# EasyEDA Pro project ProProject_Access Control EEPROM Programmer_2024-05-29.epro

# Schematic V2.0.1 Schematic
Create Date: 2024-05-29; Page Name: P1; Project Name: Access Control EEPROM Programmer; Schematic Name: V2.0.1 Schematic; Update Date: 2024-05-29; Company: EasyEDA.com; Drawn: Jim Heaney; Page Size: A4; Part Number: JLCPCB-002; Reviewed: Jim Heaney; Version: A
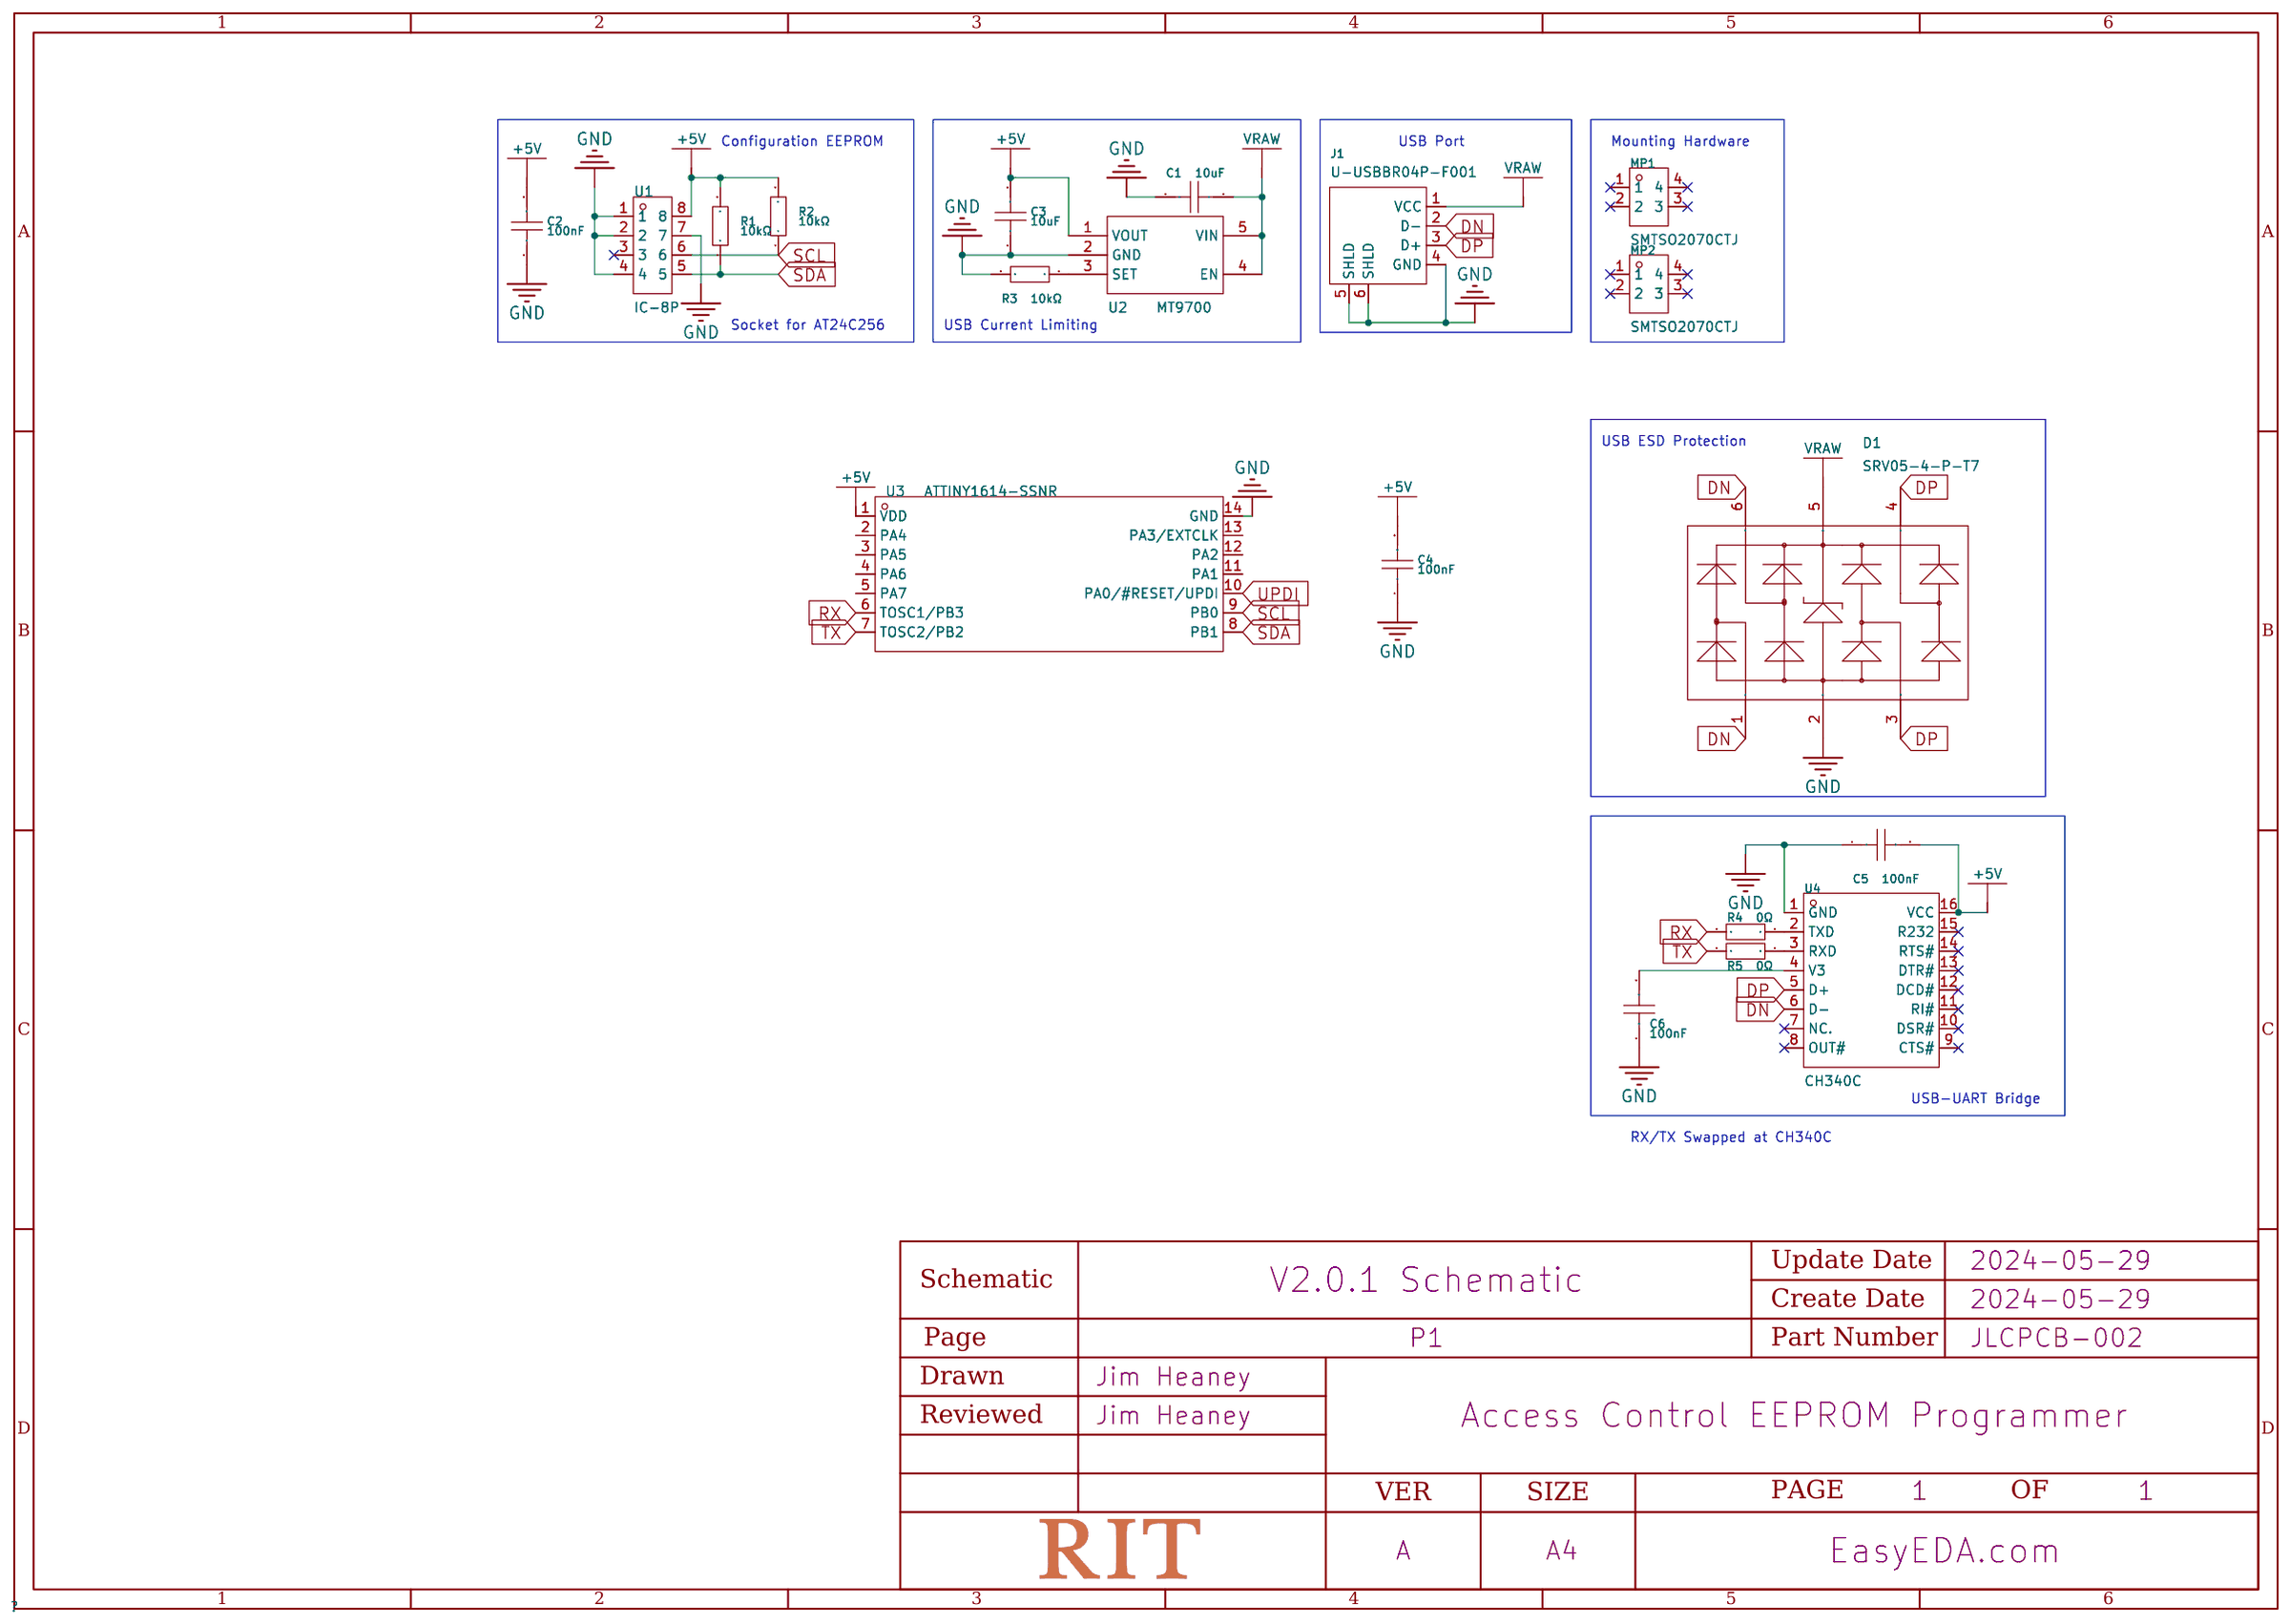
[diagram p0: schematic sheet]

## Parts
C1  10uF  [C0603]
C2  100nF  [C0603]
C3  10uF  [C0603]
C4  100nF  [C0603]
C5  100nF  [C0603]
C6  100nF  [C0603]
D1  SRV05-4-P-T7  [SOT-23-6_L2.9-W1.6-P0.95-LS2.8-BR]
J1  U-USBBR04P-F001  [USB-B-TH_U241-041N-1BR85-1]
MP1  SMTSO2070CTJ  [SMD_BD5.6-L5.6-W5.6-D3.6]
MP2  SMTSO2070CTJ  [SMD_BD5.6-L5.6-W5.6-D3.6]
R1  10kΩ  [R0603]
R2  10kΩ  [R0603]
R3  10kΩ  [R0603]
R4  0Ω  [R1206]
R5  0Ω  [R1206]
U1  IC-8P  [DIP-8_L10.2-W10.1-P2.54-LS7.6-BL]
U2  MT9700  [SOT-23-5_L3.0-W1.7-P0.95-LS2.8-BR]
U3  ATTINY1614-SSNR  [SOIC-14_L8.7-W3.9-P1.27-LS6.0-BL]
U4  CH340C  [SOP-16_L10.0-W3.9-P1.27-LS6.0-BL]

## Library data of the parts
C1 C3 = CL10A106MA8NRNC: Capacitance: Tolerance:±20% Tolerance:±20% Voltage Rated: Temperature Coefficient:; LCSC Part Name: 10uF ±20% 25V; Supplier Part: C96446; Manufacturer: SAMSUNG(三星); Supplier Footprint: 0603; JLCPCB Part Class: Basic Part; Datasheet: https://atta.szlcsc.com/upload/public/pdf/source/20160218/1457707763339.pdf; Supplier: LCSC; Tolerance: ±20%
C2 C4-C6 = CC0603KRX7R9BB104: Capacitance: Tolerance:±10% Tolerance:±10% Voltage Rated: Temperature Coefficient:; LCSC Part Name: 100nF ±10% 50V; Supplier Part: C14663; Manufacturer: YAGEO(国巨); Supplier Footprint: 0603; JLCPCB Part Class: Basic Part; Datasheet: https://atta.szlcsc.com/upload/public/pdf/source/20180910/C282072_33301C7F631E79921B82A8DAC6BCC5B3.pdf; Supplier: LCSC; Tolerance: ±10%
D1 = SRV05-4-P-T7_C85364: Reverse Stand-Off Voltage (Vrwm):5V Breakdown Voltage:6V Peak Pulse Current (Ipp)@10/1000s:1A@8/20us Maximum Clamping Voltage:12V; LCSC Part Name: Vrwm:5V; Supplier Part: C85364; Manufacturer: PROTEK; Supplier Footprint: SOT-23-6; Datasheet: https://atta.szlcsc.com/upload/public/pdf/source/20161024/1477288764689.pdf; Supplier: LCSC; Reverse Stand-Off Voltage (Vrwm): 5V; Breakdown Voltage: 6V; Peak Pulse Current (Ipp)@10/1000μs: 1A@8/20us; Maximum Clamping Voltage: 12V
J1 = U-USBBR04P-F001: Connector Type:Type-B Standard:USB 2.0 Gender:Female Number of Ports:1 Number of Contacts:4P Mounting Style:Right-Angle Current Rating - Power (Max):1.5A Operating Temperature Range:- Operating Temperature Range:-; LCSC Part Name: Type-B 母 弯插; Supplier Part: C386743; Manufacturer: Ckmtw(灿科盟); Supplier Footprint: 插件; JLCPCB Part Class: Extended Part; Datasheet: https://atta.szlcsc.com/upload/public/pdf/source/20190509/C386743_2E7BDE199FB40B6F97679D15D491C286.pdf; Supplier: LCSC; Connector Type: Type-B; Standard: USB 2.0; Gender: Female; Number of Ports: 1; Number of Contacts: 4P; Mounting Style: Right-Angle; Current Rating - Power (Max): 1.5A
MP1 MP2 = SMTSO2070CTJ: specifications:M2X7 surface treatment:镀锡 Product Description:- material quality:- model:SMTSO2070CTJ brand:Sinhoo(雄和远景); LCSC Part Name: 雄和远景，电路板表贴圆螺母柱，M2X7，铜镀锡,1个; Supplier Part: C2916355; Manufacturer: Sinhoo(雄和远景); JLCPCB Part Class: Extended Part; Datasheet: https://atta.szlcsc.com/upload/public/pdf/source/20211122/17CF5E24EB4D4DC090A80DE3D7DE5E21.pdf; Supplier: LCSC; specifications: M2X7; surface treatment: 镀锡; brand: Sinhoo(雄和远景)
R1-R3 = 0603WAF1002T5E: Type:Thick Film Resistors Resistance:10kΩ Tolerance:±1% Tolerance:±1% Power(Watts): Overload Voltage (Max): Temperature Coefficient:±100ppm/℃ Temperature Coefficient:±100ppm/℃ Operating Temperature Range:-55℃~+155℃ Operating Temperature Range:-55℃~+155℃; LCSC Part Name: 厚膜电阻 10kΩ ±1% 100mW; Supplier Part: C25804; Manufacturer: UNI-ROYAL(厚声); Supplier Footprint: 0603; JLCPCB Part Class: Basic Part; Datasheet: https://atta.szlcsc.com/upload/public/pdf/source/20200306/C422600_1E6D84923E4A46A82E41ADD87F860B5C.pdf; Supplier: LCSC; Type: Thick Film Resistors; Tolerance: ±1%; Temperature Coefficient: ±100ppm/℃; Operating Temperature Range: -55℃~+155℃
R4 R5 = 1206W4F0000T5E: Type:Thick Film Resistors Resistance: Tolerance:±1% Tolerance:±1% Power(Watts): Overload Voltage (Max): Temperature Coefficient:±800ppm/℃ Temperature Coefficient:±800ppm/℃ Operating Temperature Range:-55℃~+155℃ Operating Temperature Range:-55℃~+155℃; LCSC Part Name: 0Ω ±1% 250mW 厚膜电阻; Supplier Part: C17888; Manufacturer: UNI-ROYAL(厚声); Supplier Footprint: 1206; JLCPCB Part Class: Basic Part; Datasheet: https://atta.szlcsc.com/upload/public/pdf/source/20200306/C422600_1E6D84923E4A46A82E41ADD87F860B5C.pdf; Supplier: LCSC; Type: Thick Film Resistors; Tolerance: ±1%; Temperature Coefficient: ±800ppm/℃; Operating Temperature Range: -55℃~+155℃
U1 = IC-8P: Number of Positions:8P; LCSC Part Name: P数:8P; Supplier Part: C5289485; Manufacturer: ZHOURI(洲日); Supplier Footprint: DIP-8; JLCPCB Part Class: Extended Part; Datasheet: https://atta.szlcsc.com/upload/public/pdf/source/20221125/3E83BD656FA58AC4D44626E20A8B2E8F.pdf; Supplier: LCSC; Number of Positions: 8P
U2 = MT9700: Supplier Part: C89855; Manufacturer: 西安航天民芯; Supplier Footprint: SOT-23-5; JLCPCB Part Class: Extended Part; Datasheet: https://atta.szlcsc.com/upload/public/pdf/source/20170418/1492481333031.pdf; Supplier: LCSC
U3 = ATTINY1614-SSNR: CPU Core:AVR Program Storage Size:16KB RAM Size:2KB GPIO Ports Number:12 Operating Voltage Range:1.8V~5.5V Operating Voltage Range:1.8V~5.5V CPU Maximum Speed:20MHz Program Memory Type:FLASH Operating Temperature Range:-40℃~+105℃ Operating Temperature Ran; Supplier Part: C481364; Manufacturer: MICROCHIP(美国微芯); Supplier Footprint: SOIC-14; JLCPCB Part Class: Extended Part; Datasheet: https://atta.szlcsc.com/upload/public/pdf/source/20210602/FC8A9F430ECD1E098D2B5E95CDE2B28C.pdf; Supplier: LCSC; CPU Core: AVR; Program Storage Size: 16KB; RAM Size: 2KB; GPIO Ports Number: 12; Operating Voltage Range: 1.8V~5.5V; CPU Maximum Speed: 20MHz; Program Memory Type: FLASH; Operating Temperature Range: -40℃~+105℃; ADC (Bit): 10bit; DAC (Bit): 8bit; Peripheral/Function: WDT；PWM; Watchdog: 有; Infrared Data Association: 有; Low-Voltage Detect: 有; Internal Oscillator: 有
U4 = CH340C: Applications Function:Transceiver Protocol: Supply Voltage:3.3V；5V Supply Voltage:3.3V；5V Data Rate:2Mbps; LCSC Part Name: CH340C USB转串口芯片 CH340; Supplier Part: C84681; Manufacturer: WCH(南京沁恒); Supplier Footprint: SOP-16; JLCPCB Part Class: Extended Part; Datasheet: https://atta.szlcsc.com/upload/public/pdf/source/20200819/C84681_ADBED554CE321879DBD6B1D06488689C.pdf; Supplier: LCSC; Applications Function: Transceiver; Supply Voltage: 3.3V；5V; Data Rate: 2Mbps

## Nets
+5V: C2.2 C3.2 C4.2 C5.2 R1.2 R2.2 U1.8 U2.1(VOUT) U3.1(VDD) U4.16(VCC)
GND: C1.2 C2.1 C3.1 C4.1 C5.1 C6.1 D1.2 J1.4(GND) J1.5(SHLD) J1.6(SHLD) R3.2 U1.1 U1.2 U1.4 U1.7 U2.2(GND) U3.14(GND) U4.1(GND)
DN: D1.1 D1.6 J1.2(D-) U4.6(D-)
DP: D1.3 D1.4 J1.3(D+) U4.5(D+)
RX: R4.1 U3.6(TOSC1/PB3)
SCL: R2.1 U1.6 U3.9(PB0)
SDA: R1.1 U1.5 U3.8(PB1)
TX: R5.1 U3.7(TOSC2/PB2)
UPDI: U3.10(PA0/#RESET/UPDI)
VRAW: C1.1 D1.5 J1.1(VCC) U2.4(EN) U2.5(VIN)
$1N649: C6.2 U4.4(V3)
$1N660: R4.2 U4.2(TXD)
$1N661: R5.2 U4.3(RXD)
$1N1003: R3.1 U2.3(SET)

Not connected (* = marked no-connect by the designer): MP1 1* 2* 3* 4*; MP2 1* 2* 3* 4*; U1 3*; U3 2(PA4) 3(PA5) 4(PA6) 5(PA7) 11(PA1) 12(PA2) 13(PA3/EXTCLK); U4 7(NC.)* 8(OUT#)* 9(CTS#)* 10(DSR#)* 11(RI#)* 12(DCD#)* 13(DTR#)* 14(RTS#)* 15(R232)*

## Notes on the sheet
- Configuration EEPROM
- USB Port
- Mounting Hardware
- Socket for AT24C256
- USB Current Limiting
- USB ESD Protection
- USB-UART Bridge
- RX/TX Swapped at CH340C

# Board V2.0.1 PCB
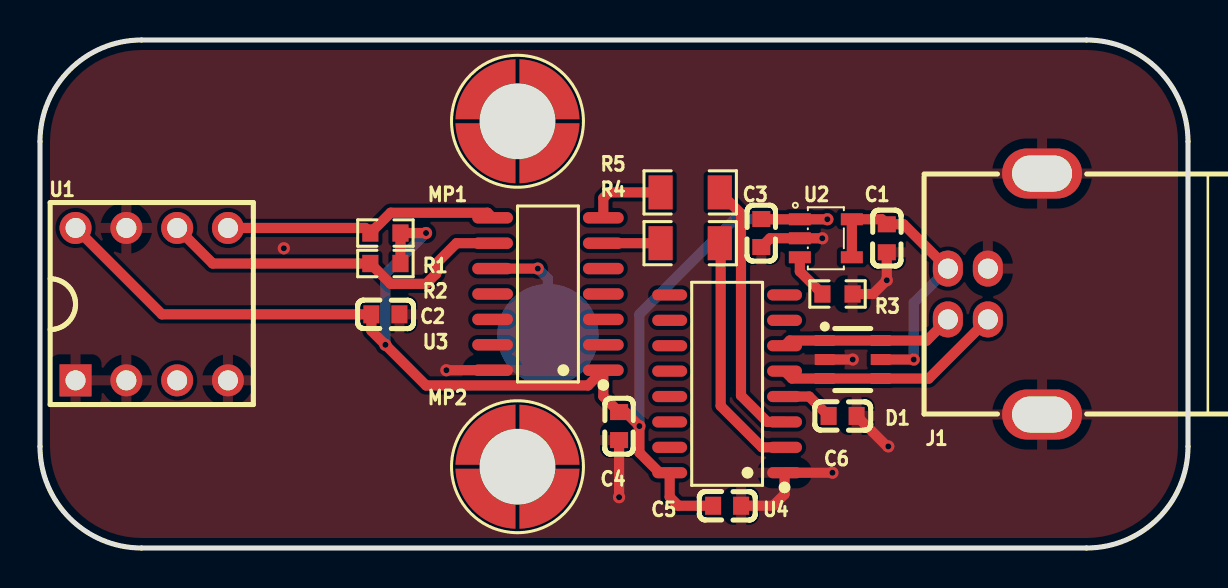
[diagram p1: board, top side]
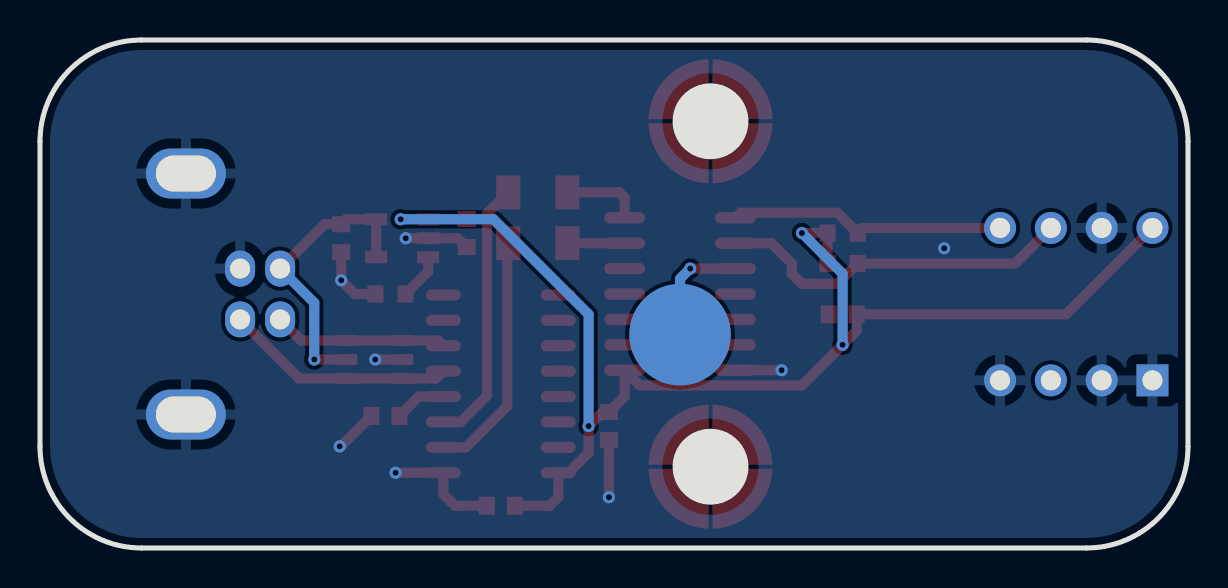
[diagram p2: board, bottom side, seen from below]

Outline 57.4 x 25.4 mm; copper layers: Top Layer, Bottom Layer. Coordinates in mm from the lower left corner of the outline.
Outline path: 0,20.32 0,5.08 arc(1.49,1.49) 5.08,0 52.32,0 arc(55.92,1.49) 57.4,5.08 57.4,20.32 arc(55.92,23.91) 52.32,25.4 5.08,25.4 arc(1.49,23.91) 0,20.32
Stack: Top Layer 0.035mm / Dielectric1 1.51mm FR4 er 4.5 / Bottom Layer 0.035mm

## Design rules (mm)
template: JLCPCB Capability(Two Layers Board)
spacing copperThickness1oz (default): track to track 0.102, other pairs 0.152 to 0.3
spacing copperThickness2oz: track to track 0.203, other pairs 0.152 to 0.3
track width copperThickness1oz (default): min 0.127, default 0.254, max 2.54
track width copperThickness2oz: min 0.203, default 0.254, max 2.54
differential pair differentialPair (default): width min 0.127, default 0.254, max 2.54; gap min 0.152, default 0.152
via viaSize (default): diameter min 0.5, default 0.61, max 10; hole min 0.3, default 0.305, max 6.3

## Placement (name value [footprint] x y rotation side)
C1  10uF  [C0603]  42.34 15.49 270 top
C2  100nF  [C0603]  17.27 11.68 180 top
C3  10uF  [C0603]  36.07 15.75 90 top
C4  100nF  [C0603]  28.96 6.1 90 top
C5  100nF  [C0603]  34.36 2.11 180 top
C6  100nF  [C0603]  40.13 6.6 180 top
D1  SRV05-4-P-T7  [SOT-23-6_L2.9-W1.6-P0.95-LS2.8-BR]  40.64 9.42 180 top
J1  U-USBBR04P-F001  [USB-B-TH_U241-041N-1BR85-1]  47.75 12.7 90 top
MP1  SMTSO2070CTJ  [SMD_BD5.6-L5.6-W5.6-D3.6]  23.88 21.34 0 top
MP2  SMTSO2070CTJ  [SMD_BD5.6-L5.6-W5.6-D3.6]  23.88 4.06 0 top
NOREF  -  [Pad_e149]  25.4 10.67 0 top
R1  10kΩ  [R0603]  17.27 15.75 0 top
R2  10kΩ  [R0603]  17.27 14.22 0 top
R3  10kΩ  [R0603]  39.88 12.7 0 top
R4  0Ω  [R1206]  32.51 15.24 0 top
R5  0Ω  [R1206]  32.51 17.78 0 top
U1  IC-8P  [DIP-8_L10.2-W10.1-P2.54-LS7.6-BL]  5.59 12.19 0 top
U2  MT9700  [SOT-23-5_L3.0-W1.7-P0.95-LS2.8-BR]  39.29 15.49 180 top
U3  ATTINY1614-SSNR  [SOIC-14_L8.7-W3.9-P1.27-LS6.0-BL]  25.4 12.7 90 top
U4  CH340C  [SOP-16_L10.0-W3.9-P1.27-LS6.0-BL]  34.36 8.21 90 top

## Footprints (pads in the part's own frame, mm; a bottom-side part is the same pattern mirrored in y, then rotated)
C0603
  rect 0.8x0.9 smd: 1(-0.7,0) 2(0.7,0)
DIP-8_L10.2-W10.1-P2.54-LS7.6-BL
  rect 1.6x1.6 hole 1: 1(-3.81,-3.81)
  round 1.6 hole 1: 2(-1.27,-3.81) 3(1.27,-3.81) 4(3.81,-3.81) 5(3.81,3.81) 6(1.27,3.81) 7(-1.27,3.81) 8(-3.81,3.81)
Pad_e149
  round 5.08 smd far side: 17(0,0)
R0603
  rect 0.806x0.864 smd: 1(-0.753,0) 2(0.753,0)
R1206
  rect 1.208x1.701 smd: 1(-1.479,0) 2(1.479,0)
SMD_BD5.6-L5.6-W5.6-D3.6
  custom 3x3 smd: 1(-1.844,1.6) 1(-1.601,-1.844) 1(1.6,1.844) 1(1.844,-1.6)
SOIC-14_L8.7-W3.9-P1.27-LS6.0-BL
  oval 0.574x2.038 smd: 1(-3.81,-2.769) 2(-2.54,-2.769) 3(-1.27,-2.769) 4(0,-2.769) 5(1.27,-2.769) 6(2.54,-2.769) 7(3.81,-2.769) 8(3.81,2.769) 9(2.54,2.769) 10(1.27,2.769) 11(0,2.769) 12(-1.27,2.769) 13(-2.54,2.769) 14(-3.81,2.769)
SOP-16_L10.0-W3.9-P1.27-LS6.0-BL
  oval 0.56x1.745 smd: 1(-4.445,-2.873) 2(-3.175,-2.873) 3(-1.905,-2.873) 4(-0.635,-2.873) 5(0.635,-2.873) 6(1.905,-2.873) 7(3.175,-2.873) 8(4.445,-2.873) 9(4.445,2.873) 10(3.175,2.873) 11(1.905,2.873) 12(0.635,2.873) 13(-0.635,2.873) 14(-1.905,2.873) 15(-3.175,2.873) 16(-4.445,2.873)
SOT-23-5_L3.0-W1.7-P0.95-LS2.8-BR
  rect 1.1x0.6 smd: 1(1.3,-0.95) 2(1.3,0) 3(1.3,0.95) 4(-1.3,0.95) 5(-1.3,-0.95)
SOT-23-6_L2.9-W1.6-P0.95-LS2.8-BR
  rect 1x0.55 smd: 1(1.4,-0.95) 2(1.4,0) 3(1.4,0.95) 4(-1.4,0.95) 5(-1.4,0) 6(-1.4,-0.95)
USB-B-TH_U241-041N-1BR85-1
  oval 1.8x1.5 hole 1: 1(1.27,2.355) 2(-1.27,2.355) 3(-1.27,0.355) 4(1.27,0.355)
  oval 2.5x4 hole 1.8x3: 5(6.025,-2.355) 6(-6.025,-2.355)

## Nets
As in the schematic, except:
UPDI: NOREF.17 U3.10

Pads without a net: MP1 1; MP2 1; U1 3; U3 2 3 4 5 11 12 13; U4 7 8 9 10 11 12 13 14 15

## Via types
v1: diameter 0.61, hole 0.305, Top Layer to Bottom Layer, 14 vias

## Routing (per net, layer and track width the routed paths; a pad name or vN(x,y) marks a point on that pad's centre or on a via; arc(x,y) is an arc through that point)
+5V: length 70.5
  Top Layer w0.508: v1(39.37,16.44) U2.1 36.08,16.44 C3.2 ; C5.2 31.92,2.11 31.49,2.55 U4.16 30.98,3.76 29.97,4.77 v1(29.97,6.1) 29.27,6.8 C4.2 28.17,7.58 U3.1 27.41,8.13 19.3,8.13 v1(17.27,10.16) 16.57,10.86 C2.2 6.1,11.68 U1.8 ; v1(19.3,15.75) R1.2 R2.2
  Bottom Layer w0.508: v1(17.27,10.16) 17.27,13.72 v1(19.3,15.75) ; v1(29.97,6.1) 29.97,11.68 34.72,16.44 v1(39.37,16.44)
GND: length 21.3
  Top Layer w0.508: 22.63,8.89 v1(20.32,8.89) ; R3.2 41.66,12.7 v1(42.34,13.39) C1.2 ; v1(39.62,3.76) U4.1 37.23,2.69 36.66,2.11 C5.1 ; C4.1 v1(28.96,2.54) ; v1(42.42,5.08) 42.36,5.08 C6.1 ; D1.2 v1(40.64,9.42) ; v1(39.12,15.49) U2.2 36.51,15.49 C3.1
  vias: v1(12.19,14.99)
DN: length 8.7
  Top Layer w0.508: J1.2 44.34,10.37 D1.6 D1.1 37.49,10.37 U4.6
DP: length 11.5
  Top Layer w0.508: J1.3 44.44,8.47 D1.4 D1.3 37.6,8.47 U4.5
RX: length 2.9
  Top Layer w0.508: R4.1 U3.6
SCL: length 18.1
  Top Layer w0.508: U1.6 8.64,14.22 R2.1 17.53,13.21 19.3,13.21 19.81,13.72 19.81,14.22 20.83,15.24 22.63,15.24
SDA: length 13.9
  Top Layer w0.508: 22.63,16.51 22.38,16.76 17.53,16.76 R1.1 16.26,16 U1.5
TX: length 4
  Top Layer w0.508: U3.7 28.17,17.5 28.45,17.78 R5.1
UPDI: length 5.8
  Top Layer w0.508: 22.63,13.97 v1(24.89,13.97)
  Bottom Layer w0.508: v1(24.89,13.97) 25.4,13.46 NOREF.17
VRAW: length 14.6
  Top Layer w0.508: J1.1 43.18,16.19 C1.1 42.09,16.44 U2.5 U2.4 ; D1.5 v1(43.69,9.42)
  Bottom Layer w0.508: v1(43.69,9.42) 43.69,12.26 J1.1
$1N649: length 2.6
  Top Layer w0.508: U4.4 38.46,7.57 C6.2
$1N660: length 12.2
  Top Layer w0.508: U4.2 36.1,5.03 34.04,7.1 34.04,15.2 R4.2
$1N661: length 13.3
  Top Layer w0.508: U4.3 36.37,6.3 35.05,7.62 35.05,16.72 R5.2
$1N1003: length 2.3
  Top Layer w0.508: R3.1 37.99,13.83 U2.3

## Copper pours and planes (outline as drawn; the poured copper is in the pictures)
GND on Top Layer: -4.57,27.43 66.04,27.43 66.04,-1.52 -4.57,-1.52
GND on Bottom Layer: -1.02,32 57.91,32 57.91,-6.1 -1.02,-6.1
